# EAGLE design freqCounterV4 (EAGLE 9.2.2)
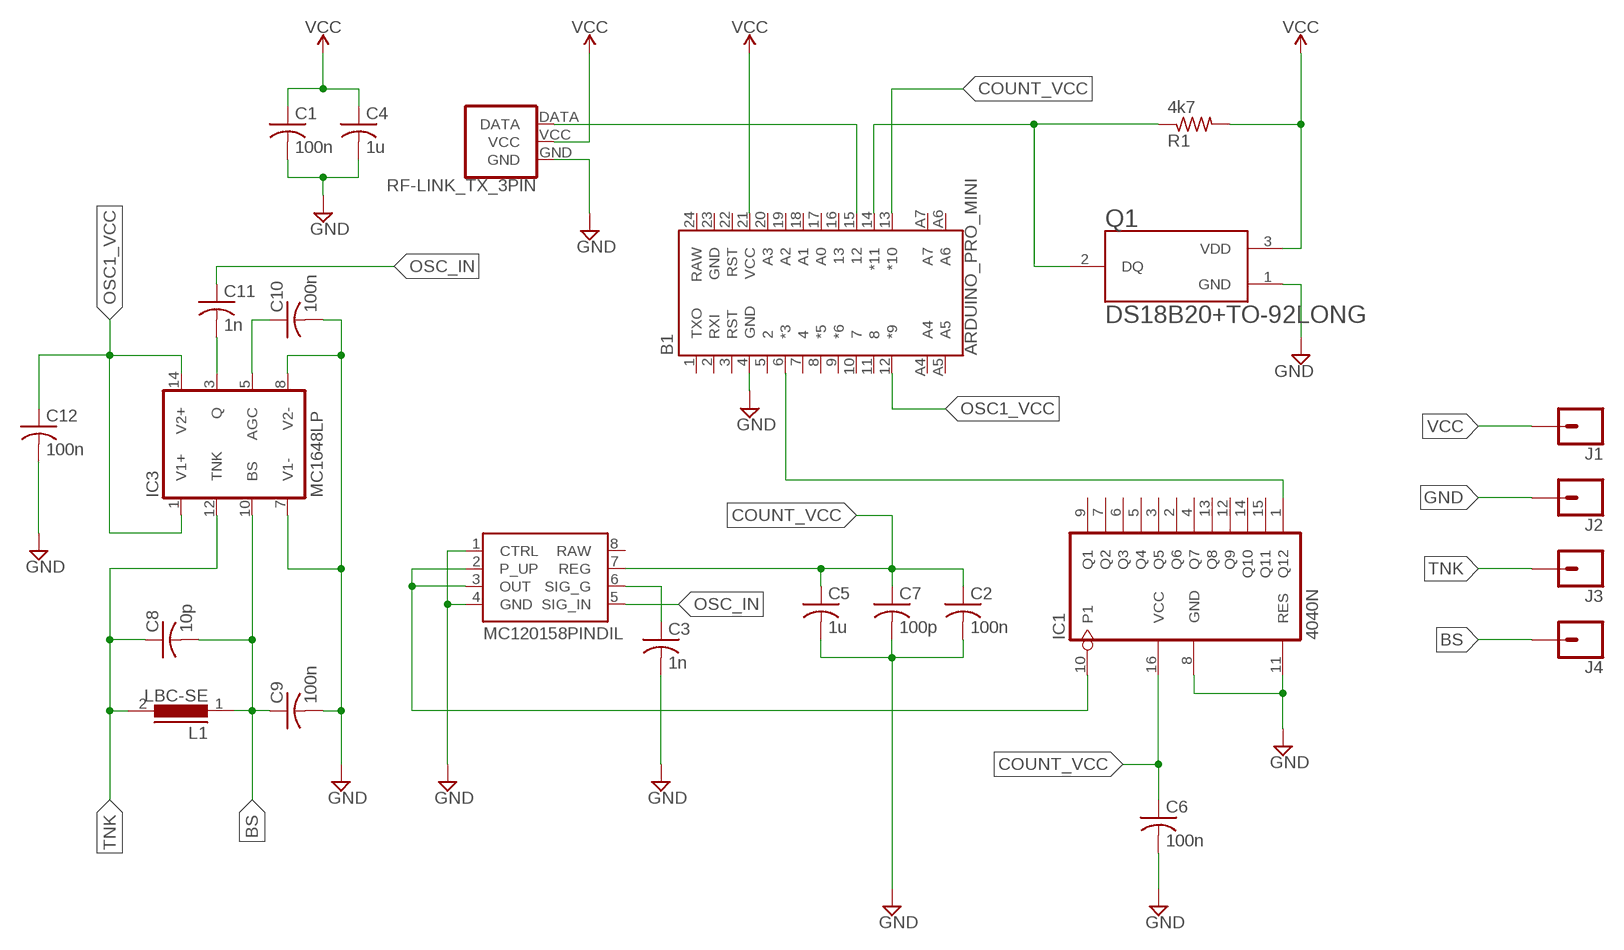
[diagram p0: schematic, sheet 1]

## Parts
B1  ARDUINO_PRO_MINI  [ARDUINO_PRO_MINI]
C1  100n  C-US050-025X075  [C050-025X075]
C2  100n  C-US050-025X075  [C050-025X075]
C3  1n  C-US050-025X075  [C050-025X075]
C4  1u  C-US025-025X050  [C025-025X050]
C5  1u  C-US050-025X075  [C050-025X075]
C6  100n  C-US075-032X103  [C075-032X103]
C7  100p  C-US050-025X075  [C050-025X075]
C8  10p  C-US050-025X075  [C050-025X075]
C9  100n  C-US050-025X075  [C050-025X075]
C10  100n  C-US050-025X075  [C050-025X075]
C11  1n  C-US075-032X103  [C075-032X103]
C12  100n  C-US050-025X075  [C050-025X075]
IC1  4040N  [DIL16]
IC2  MC120158PINDIL  [DIL08]
IC3  MC1648LP  [DIL14]
J1  CONN_01  [1X01]
J2  CONN_01  [1X01]
J3  CONN_01  [1X01]
J4  CONN_01  [1X01]
L1  LBC-SE  [LBC-SE]
Q1  DS18B20+TO-92LONG  [TO-92_0.1"]
R1  4k7  R-US_0204/2V  [0204V]
U$2  RF-LINK_TX_3PIN  [RF-LINK_TX_3PIN]

## Nets
BS: C8.2 C9.1 IC3.10(BS) J4.1 L1.1
COUNT_VCC: B1.13(*10) C2.1 C5.1 C6.1 C7.1 IC1.16(VCC) IC2.7(REG)
GND: B1.4(GND) C1.2 C2.2 C3.2 C4.2 C5.2 C6.2 C7.2 C9.2 C10.2 C12.2 IC1.8(GND) IC1.11(RES) IC2.1(CTRL) IC2.4(GND) IC3.7(V1-) IC3.8(V2-) J2.1 Q1.1(GND) U$2.GND
N$1: IC1.10(P1) IC2.2(P_UP) IC2.3(OUT)
N$2: C3.1 IC2.6(SIG_G)
N$3: B1.6(*3) IC1.1(Q12)
N$4: C11.2 IC3.3(Q)
N$5: B1.15 U$2.DATA
N$6: B1.14(*11) Q1.2(DQ) R1.1
N$9: C10.1 IC3.5(AGC)
OSC1_VCC: B1.12(*9) C12.1 IC3.1(V1+) IC3.14(V2+)
OSC_IN: C11.1 IC2.5(SIG_IN)
TNK: C8.1 IC3.12(TNK) J3.1 L1.2
VCC: B1.21(VCC) C1.1 C4.1 J1.1 Q1.3(VDD) R1.2 U$2.VCC
Unconnected: B1.1(TXO) B1.2(RXI) B1.3(RST) B1.5 B1.7 B1.8(*5) B1.9(*6) B1.10 B1.11 B1.16 B1.17(A0) B1.18(A1) B1.19(A2) B1.20(A3) B1.22(RST) B1.A4 B1.A5 B1.A6 B1.A7 IC1.2(Q6) IC1.3(Q5) IC1.4(Q7) IC1.5(Q4) IC1.6(Q3) IC1.7(Q2) IC1.9(Q1) IC1.12(Q9) IC1.13(Q8) IC1.14(Q10) IC1.15(Q11)

## Power pins joined to a net without a drawn wire
GND: B1.23(GND)
RAW: B1.24(RAW) IC2.8(RAW)

## Library data of the parts
B1 = SparkFun-Boards:ARDUINO_PRO_MINI: SparkFun Pro Mini Pro Mini compatible footprint. Dimensions: 0.7 x 1.3" PCB Thickness: 0.8mm SparkFun Products: 3.3V/8MHz <https://www.sparkfun.com/products/11114> 5V/16MHz <https://www.sparkfun.com/products/11113>
C1-C12 = adafruit:C-US: CAPACITOR, American symbol
IC1 = rjw_lib:4040: 12-stage binary/ripple COUNTER
IC2 = rjw_lib:MC12015: dual modulus prescalers which will drive divide by 32 and 33 Source:http://www.lansdale.com/datasheets/ML12015_ML12016_ML12017_revA.pdf
IC3 = linear4:MC1648L: VCO
J1-J4 = SparkFun-Connectors:CONN_01: Single connection point. Often used as Generic Header-pin footprint for 0.1 inch spaced/style header connections On any of the 0.1 inch spaced packages, you can populate with these: Break Away Headers - Straight <https://www.sparkfun.com/products/116> (PRT-00116) Break Away Male Headers - Right Angle <https://www.sparkfun.com/products/553> (PRT-00553) Female Headers <https://www.sparkfun.com/products/115> (PRT-00115) Break Away Headers - Machine Pin <https://www.sparkfun.com/products/117> (PRT-00117) Break Away Female Headers - Swiss Machine Pin <https://www.sparkfun.com/products/743> (PRT-00743) This device is also useful as a general connection point to wire up your design to another part of your project. Our various solder wires solder well into these plated through hole pads. Hook-Up Wire - Assortment (Stranded, 22 AWG) <https://www.sparkfun.com/products/11375> (PRT-11375) Hook-Up Wire - Assortment (Solid Core, 22 AWG) <https://www.sparkfun.com/products/11367> (PRT-11367) View the entire wire category on our website here <https://www.sparkfun.com/categories/141> Special notes: SMTSO-256-ET is a "flush mount" nut for a 4-40 screw. We mostly use this on specialty testbeds; it is a nice way to connect hardware to your PCB at an adjustable hieght. Also note, the SNAP packages are for using a snappable style connector. We sell a baggie of snaps and they are also used on two LilyPad designs: Snap Assortment - 30 pack (male and female) <https://www.sparkfun.com/products/11347> (DEV-11347) LilyPad Arduino SimpleSnap <https://www.sparkfun.com/products/10941> (DEV-10941) LilyPad SimpleSnap Protoboard <https://www.sparkfun.com/products/10940> (DEV-10940)
L1 = inductors:LBC-SE: INDUCTOR; SPICEPREFIX: L
Q1 = DS18B20_:DS18B20+: Temperature sensor; digital thermometer; -55÷125°C; TO92; THT
R1 = adafruit:R-US_: RESISTOR, American symbol
U$2 = rjw_lib:RF-LINK_TX_3PIN: RF Link Transmitter (434 MHz, 315 MHz) MX-05V 433MHZ RF Wireless Receiver Module MX-FS-03V Transmitter Module Kit Transmission Distance :20-200 m (dependent on supply voltage) Operating Voltage :3.5-12V Dimensions: 19 * 19mm AM transfer rate: 4Kb/s (4000 bits per second) Transmission power: 10mW Emission frequency: 433M SparkFun Products RF Link Transmitter - 434MHz <https://www.sparkfun.com/products/10534> (WRL-10534)

## Board
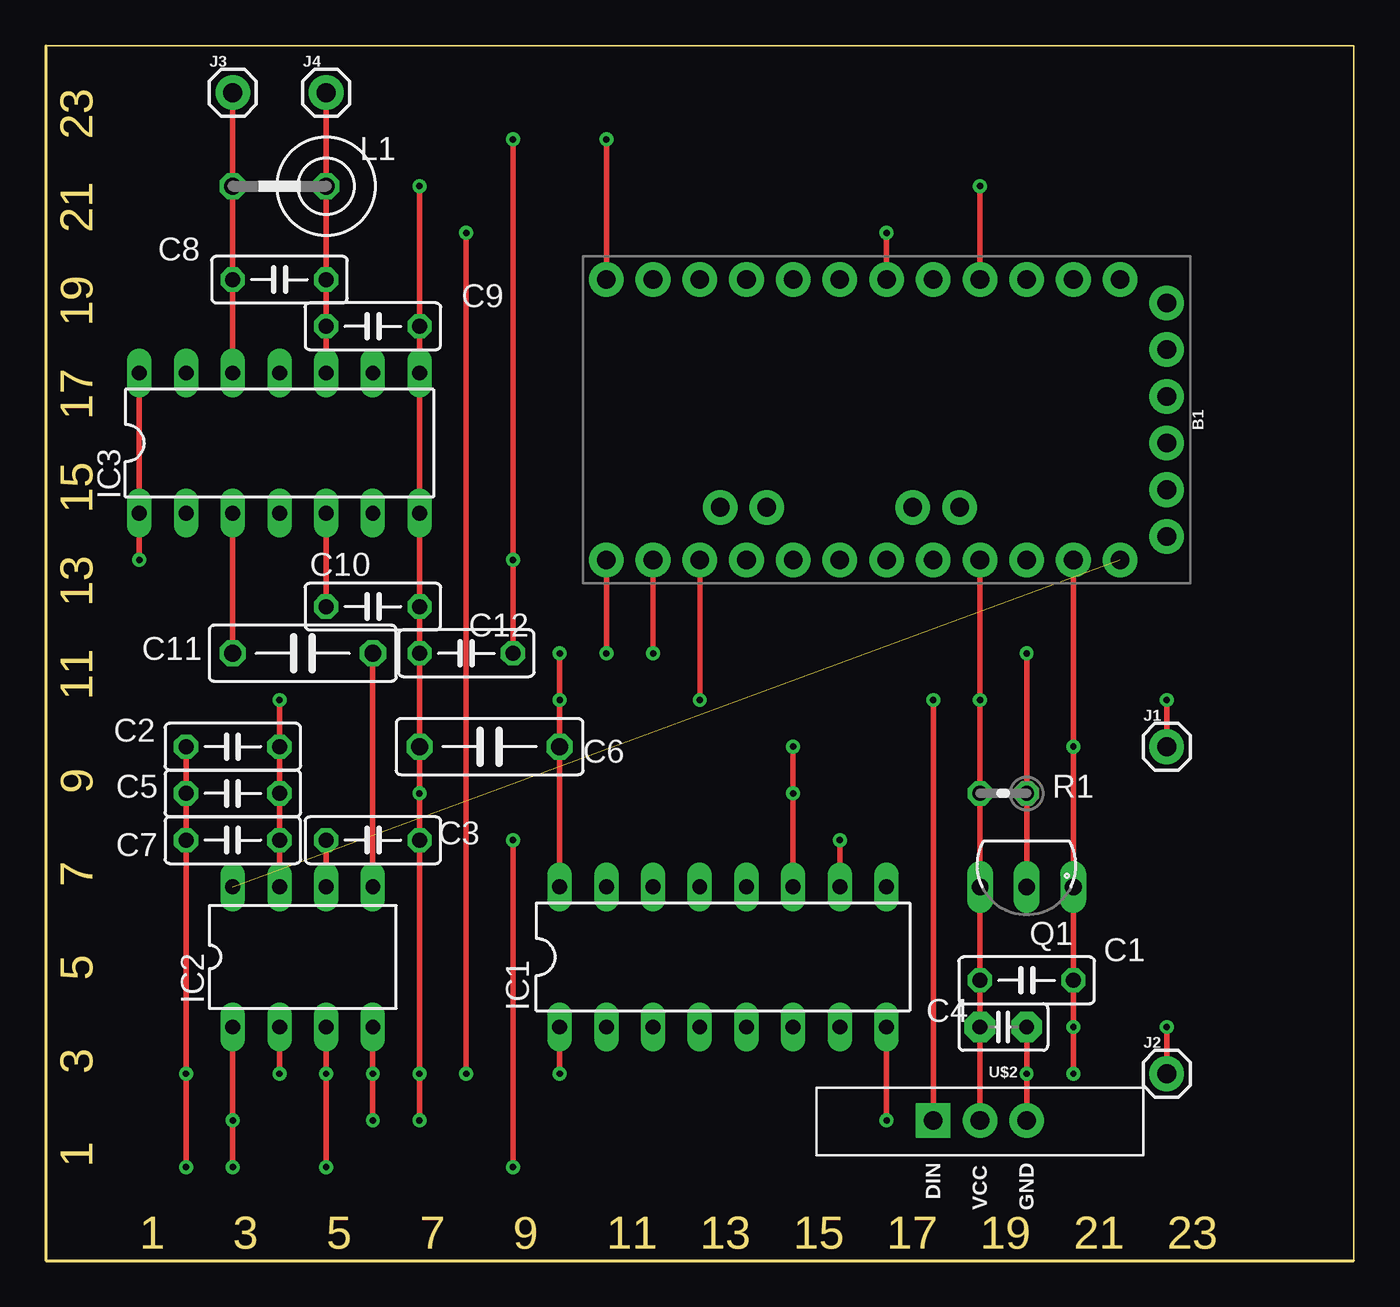
[diagram p1: board, top side]
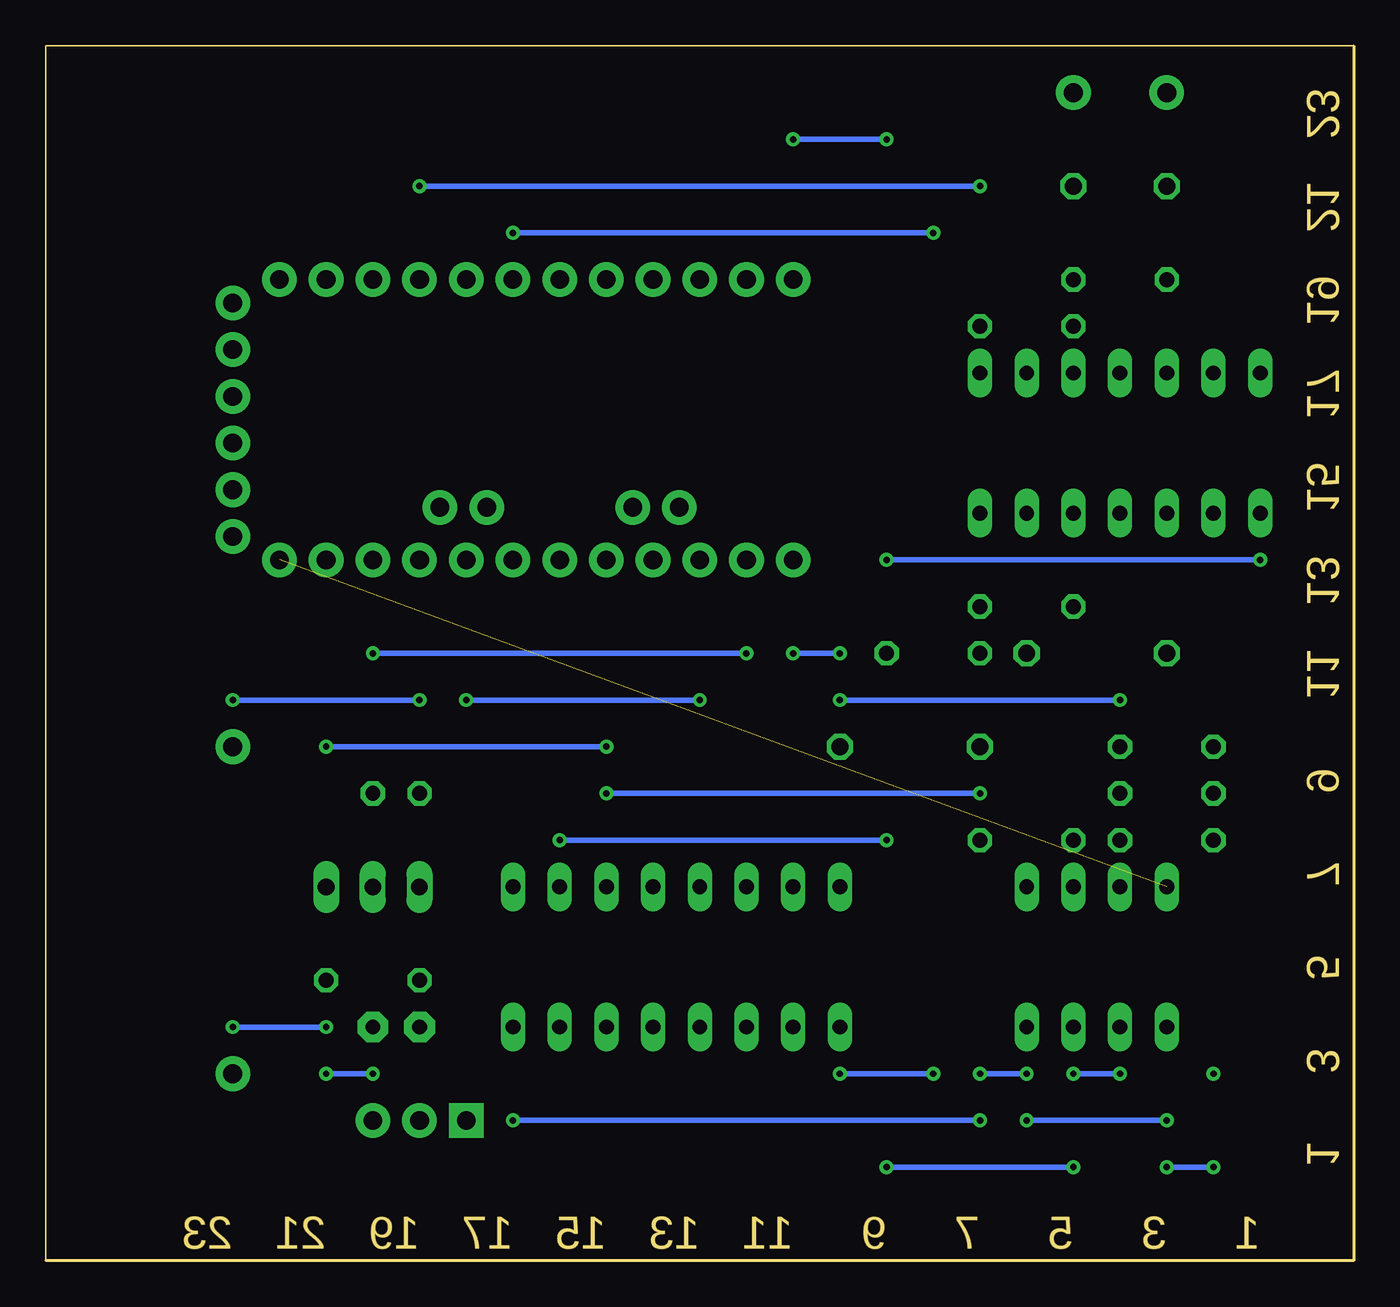
[diagram p2: board, bottom side, seen from below]

Size 71.12 x 66.04 mm. Coordinates in mm from the lower left corner, seen from the top.
Outline: 0,66.04 71.12,66.04 71.12,0 0,0 0,66.04
Copper layers (1*16): Top 0.035mm / dielectric 1.5mm / Bottom 0.035mm
Design rules "default": minimum track width 6mil, minimum drill 0.35mm, track to track 6mil, track to pad 6mil, pad to pad 6mil, via to via 6mil, smd to smd 6mil, copper to edge 40mil, drill to drill 6mil, minimum pad ring 10mil, minimum via ring 8mil, stop-mask expansion 4mil, vias tented up to drill 0mil, thermal gap 10mil

### Footprints (pad centres in the part's own frame; a part is rotated, then mirrored left to right if it is on the bottom)
ARDUINO_PRO_MINI = drill 1.016 pad 1.88: 1 -7.62,12.7; 2 -7.62,10.16; 3 -7.62,7.62; 4 -7.62,5.08; 5 -7.62,2.54; 6 -7.62,0; 7 -7.62,-2.54; 8 -7.62,-5.08; 9 -7.62,-7.62; 10 -7.62,-10.16; 11 -7.62,-12.7; 12 -7.62,-15.24; 13 7.62,-15.24; 14 7.62,-12.7; 15 7.62,-10.16; 16 7.62,-7.62; 17 7.62,-5.08; 18 7.62,-2.54; 19 7.62,0; 20 7.62,2.54; 21 7.62,5.08; 22 7.62,7.62; 23 7.62,10.16; 24 7.62,12.7; A4 4.763,1.429; A5 4.763,3.969; A6 4.763,-9.049; A7 4.763,-6.509; BLK -6.35,15.24; GND -3.81,15.24; GRN 6.35,15.24; RXI 1.27,15.24; TXO 3.81,15.24; VCC -1.27,15.24
C050-025X075 = drill 0.813 octagon: 1 -2.54,0; 2 2.54,0
C025-025X050 = drill 0.813 pad 1.676 octagon: 1 -1.27,0; 2 1.27,0
C075-032X103 = drill 0.914 octagon: 1 -3.81,0; 2 3.81,0
DIL16 = drill 0.813 long: 1 -8.89,-3.81; 2 -6.35,-3.81; 3 -3.81,-3.81; 4 -1.27,-3.81; 5 1.27,-3.81; 6 3.81,-3.81; 7 6.35,-3.81; 8 8.89,-3.81; 9 8.89,3.81; 10 6.35,3.81; 11 3.81,3.81; 12 1.27,3.81; 13 -1.27,3.81; 14 -3.81,3.81; 15 -6.35,3.81; 16 -8.89,3.81
DIL08 = drill 0.813 long: 1 -3.81,-3.81; 2 -1.27,-3.81; 3 1.27,-3.81; 4 3.81,-3.81; 5 3.81,3.81; 6 1.27,3.81; 7 -1.27,3.81; 8 -3.81,3.81
DIL14 = drill 0.813 long: 1 -7.62,-3.81; 2 -5.08,-3.81; 3 -2.54,-3.81; 4 0,-3.81; 5 2.54,-3.81; 6 5.08,-3.81; 7 7.62,-3.81; 8 7.62,3.81; 9 5.08,3.81; 10 2.54,3.81; 11 0,3.81; 12 -2.54,3.81; 13 -5.08,3.81; 14 -7.62,3.81
1X01 = drill 1.016 pad 1.88: 1 0,0
LBC-SE = drill 0.914 octagon: 1 -2.54,0; 2 2.54,0
TO-92_0.1" = drill 0.9 pad 1.1 long: 1 -2.54,0; 2 0,0; 3 2.54,0
0204V = drill 0.813 octagon: 1 -1.27,0; 2 1.27,0
RF-LINK_TX_3PIN = drill 1.016 pad 1.88 square: DATA -3.81,0 | drill 1.016 pad 1.88: GND 1.27,0; VCC -1.27,0

### Placement (x,y rotation side)
B1  45.72,45.72 270 top
C1  53.34,15.24 0 top
C2  10.16,27.94 180 top
C3  17.78,22.86 0 top
C4  52.07,12.7 0 top
C5  10.16,25.4 180 top
C6  24.13,27.94 180 top
C7  10.16,22.86 180 top
C8  12.7,53.34 0 top
C9  17.78,50.8 0 top
C10  17.78,35.56 0 top
C11  13.97,33.02 180 top
C12  22.86,33.02 180 top
IC1  36.83,16.51 0 top
IC2  13.97,16.51 0 top
IC3  12.7,44.45 0 top
J1  60.96,27.94 0 top
J2  60.96,10.16 0 top
J3  10.16,63.5 0 top
J4  15.24,63.5 0 top
L1  12.7,58.42 180 top
Q1  53.34,20.32 180 top
R1  52.07,25.4 180 top
U$2  52.07,7.62 0 top

### Tracks (layer width: path | path; a pad name or v marks a point on that pad's centre or on a via)
BS
  Top 0.305: IC3.10 C9.1 C8.2 L1.1 J4.1
COUNT_VCC  (via drill 0.35)
  Top 0.305: IC2.7 C7.1 | IC2.7 C5.1 | IC2.7 C2.1 v12.7,30.48 | IC1.16 C6.1 v27.94,30.48 v27.94,33.02 | B1.13 v30.48,33.02
  Bottom 0.305: v30.48,33.02 v27.94,33.02 | v12.7,30.48 v27.94,30.48
GND  (via drill 0.35)
  Top 0.305: IC2.1 v10.16,7.62 v10.16,5.08 | v17.78,7.62 v17.78,10.16 IC2.4 | v7.62,5.08 v7.62,10.16 C7.2 C5.2 C2.2 | v20.32,7.62 v20.32,10.16 C3.2 v20.32,25.4 C6.2 C12.2 C10.2 IC3.7 IC3.8 C9.2 v20.32,58.42 | v40.64,27.94 v40.64,25.4 IC1.11 | B1.23 v55.88,27.94 Q1.1 C1.2 v55.88,12.7 v55.88,10.16 | U$2.GND v53.34,10.16 C4.2 | IC1.8 v45.72,7.62 | B1.4 v50.8,58.42 | J2.1 v60.96,12.7
  Bottom 0.305: v10.16,7.62 v17.78,7.62 | v10.16,5.08 v7.62,5.08 | v20.32,10.16 v17.78,10.16 | v40.64,25.4 v20.32,25.4 | v40.64,27.94 v55.88,27.94 | v55.88,10.16 v53.34,10.16 | v45.72,7.62 v20.32,7.62 | v50.8,58.42 v20.32,58.42 | v60.96,12.7 v55.88,12.7
N$1  (via drill 0.35)
  Top 0.305: IC2.2 v12.7,10.16 | IC2.3 v15.24,10.16 v15.24,5.08 | IC1.10 v43.18,22.86 | v25.4,5.08 v25.4,22.86
  Bottom 0.305: v12.7,10.16 v15.24,10.16 | v15.24,5.08 v25.4,5.08 | v25.4,22.86 v43.18,22.86
N$2
  Top 0.305: IC2.6 C3.1
N$3  (via drill 0.35)
  Top 0.305: B1.6 v45.72,55.88 | v22.86,55.88 v22.86,10.16 | v27.94,10.16 IC1.1
  Bottom 0.305: v45.72,55.88 v22.86,55.88 | v22.86,10.16 v27.94,10.16
N$4
  Top 0.305: IC3.3 C11.2
N$5  (via drill 0.35)
  Top 0.305: B1.15 v35.56,30.48 | v48.26,30.48 U$2.DATA
  Bottom 0.305: v35.56,30.48 v48.26,30.48
N$6  (via drill 0.35)
  Top 0.305: B1.14 v33.02,33.02 | v53.34,33.02 R1.1 Q1.2
  Bottom 0.305: v33.02,33.02 v53.34,33.02
N$9
  Top 0.305: C10.1 IC3.5
OSC1_VCC  (via drill 0.35)
  Top 0.305: IC3.14 IC3.1 v5.08,38.1 | B1.12 v30.48,60.96 | v25.4,60.96 v25.4,38.1 C12.1
  Bottom 0.305: v30.48,60.96 v25.4,60.96 | v25.4,38.1 v5.08,38.1
OSC_IN
  Top 0.305: C11.1 IC2.5
RAW  (1 unrouted)
TNK
  Top 0.305: IC3.12 C8.1 L1.2 J3.1
VCC  (via drill 0.35)
  Top 0.305: U$2.VCC C4.1 C1.1 Q1.3 R1.2 v50.8,30.48 B1.21 | J1.1 v60.96,30.48
  Bottom 0.305: v60.96,30.48 v50.8,30.48

### Text on the board
Dimension: 23 | 21 | 19 | 17 | 15 | 13 | 11 | 9 | 7 | 5 | 3 | 1 | 1 | 3 | 5 | 7 | 9 | 11 | 13 | 15 | 17 | 19 | 21 | 23
break: x | x | x | x | x | x | x | x | x | x | x | x | x | x | x | x | x | x | x | x | x | x | x | x | x | x | x | x | x | x | x | x | x | x | x | x | x | x | x | x | x | x | x | x | x